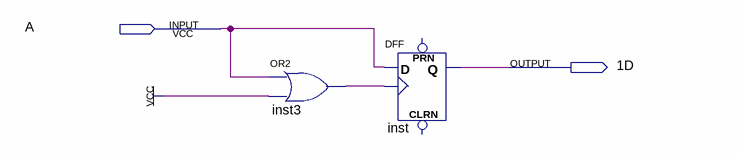
[diagram p0: schematic sheet]
// Quartus schematic Blank.bdf as structural Verilog: 2 symbols, 2 pins
module Blank (
  input  A,
  output \1D 
);

  wire inst3_out;

  or inst3 (inst3_out, A, 1'b1);
  DFF inst (.CLK(inst3_out), .D(A), .Q(\1D ));  // open: CLRN, PRN
endmodule
